# EAGLE schematic partA (EAGLE 7.4.0)
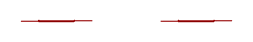
[diagram p0: schematic, sheet 1]

## Parts
R1  10k  R-EU_0207/10  [R_AXIAL]
R2  4.7k  R-EU_0207/10  [R_AXIAL]
Unconnected: R1.1 R1.2 R2.1 R2.2

## Library data of the parts
R1 R2 = rcl:R-EU_